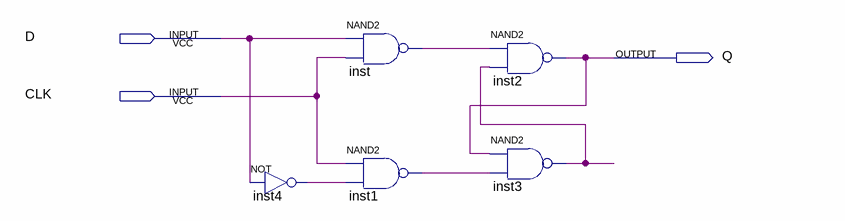
[diagram p0: schematic sheet]
// Quartus schematic step_1.bdf as structural Verilog: 5 symbols, 3 pins
module step_1 (
  input  D,
  input  CLK,
  output Q
);

  wire inst1_out, inst3_out, inst4_out, inst_out;

  not inst4 (inst4_out, D);
  nand inst (inst_out, D, CLK);
  nand inst1 (inst1_out, CLK, inst4_out);
  nand inst2 (Q, inst_out, inst3_out);
  nand inst3 (inst3_out, Q, inst1_out);
endmodule
